# Altium project 平衡车驱动板.PrjPcb
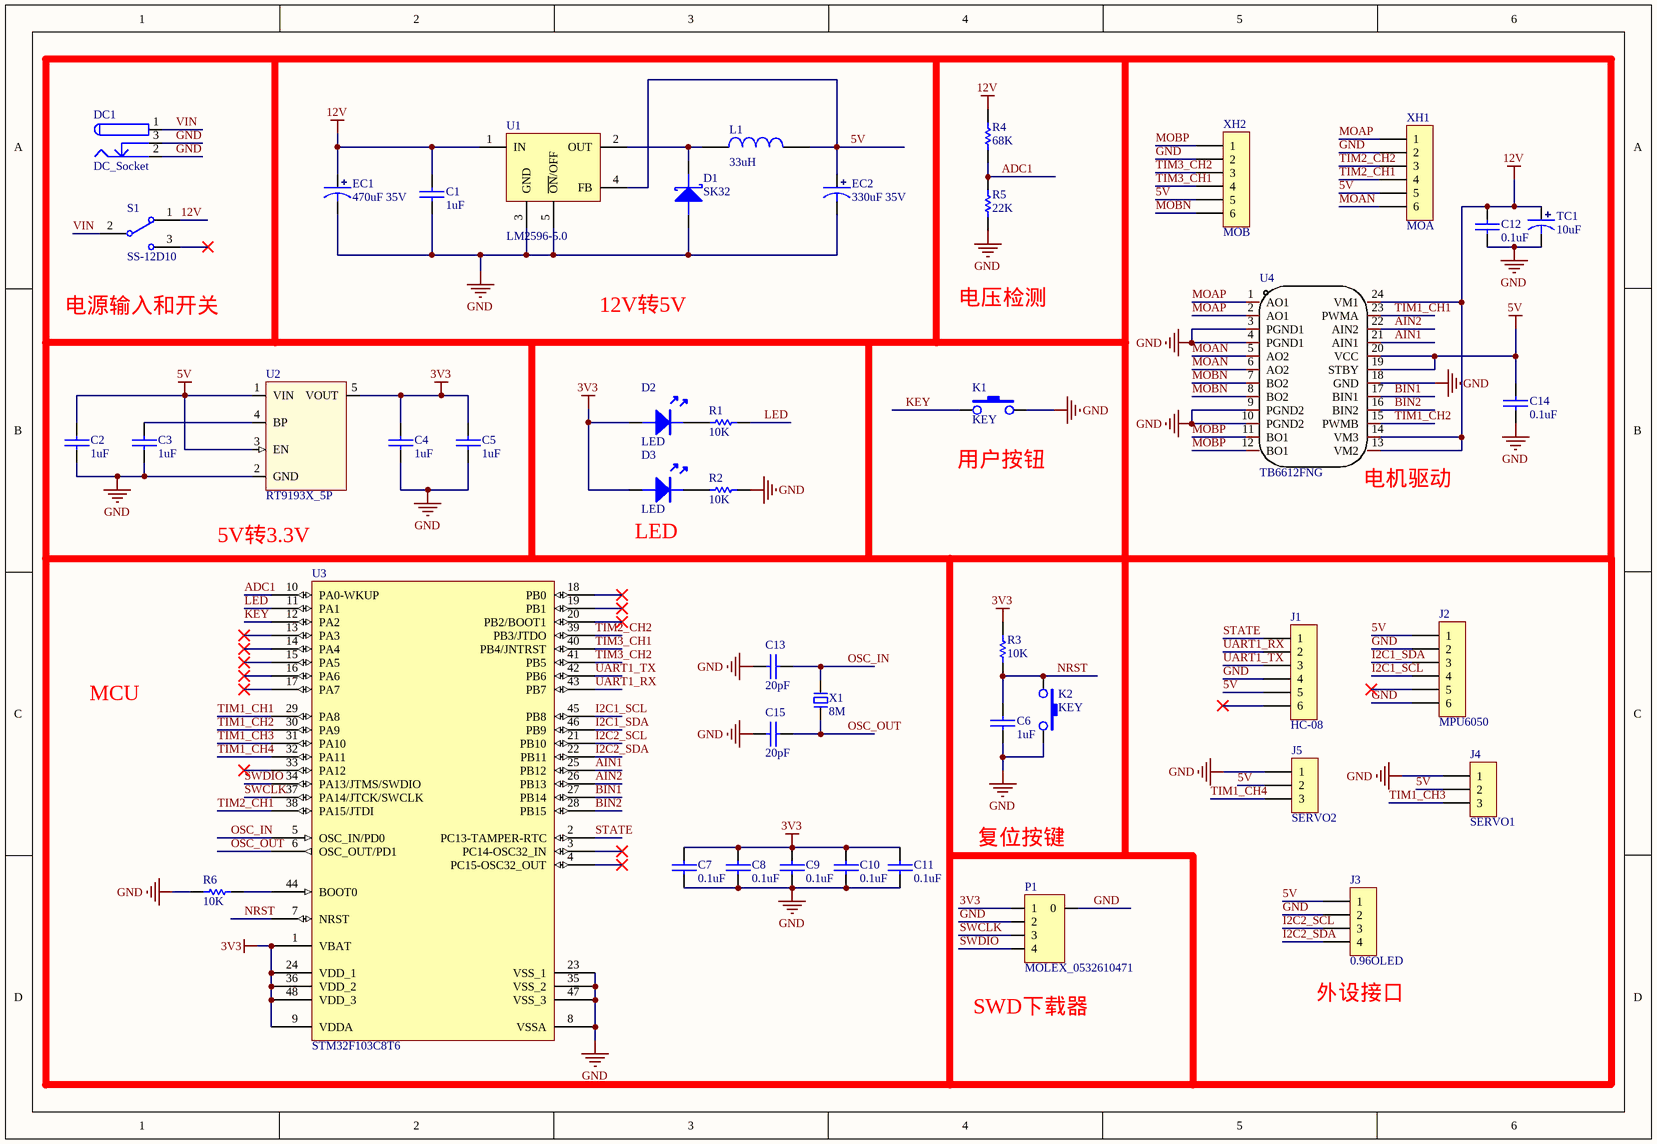
[diagram p0: 平衡车驱动板.SchDoc]
1 sheet, 45 parts. Net scope: global (net labels, ports and power ports of the same name join across sheets).
Board file: 平衡车驱动板.PcbDoc

## Sheet 平衡车驱动板.SchDoc
size 309 x 213 mm

### Parts
C1  1uF  [0603C]
C2  1uF  [0603C]
C3  1uF  [0603C]
C4  1uF  [0603C]
C5  1uF  [0603C]
C6  1uF  [0603C]
C7  0.1uF  [0603C]
C8  0.1uF  [0603C]
C9  0.1uF  [0603C]
C10  0.1uF  [0603C]
C11  0.1uF  [0603C]
C12  0.1uF  [0603C]
C13  20pF  [0603C]
C14  0.1uF  [0603C]
C15  20pF  [0603C]
D1  SK32  [SOD-123]
D2  LED  [LED-0805B]
D3  LED  [LED-0805B]
DC1  DC_Socket  [DC-050]
EC1  470uF 35V  [SMD-EC10X10X10]
EC2  330uF 35V  [SMD-EC10X10X10]
J1  HC-08  [Fe-HDR1X6/2.54-S]
J2  MPU6050  [Fe-HDR1X6/2.54-S]
J3  0.96OLED  [Fe-HDR1X4/2.54-S]
J4  SERVO1  [Pin HDR1X3/2.54mm-S]
J5  SERVO2  [Pin HDR1X3/2.54mm-S]
K1  KEY  [SMD-3X6X2.5]
K2  KEY  [SMD-3X6X2.5]
L1  33uH  [0630L]
P1  MOLEX_0532610471  [MOLEX 0532610471]
R1  10K  [0603R]
R2  10K  [0603R]
R3  10K  [0603R]
R4  68K  [0603R]
R5  22K  [0603R]
R6  10K  [0603R]
S1  SS-12D10  [SS-12D10]
TC1  10uF  [TAJ-B/3528]
U1  LM2596-5.0  [TO263-5A]
U2  RT9193X_5P  [SOT23-5L]
U3  STM32F103C8T6  [LQFP48 7X7]
U4  TB6612FNG  [TB6612-SSOP-24]
X1  8M  [OSC HC-49S]
XH1  MOA  [XH6/2.54mm/90]
XH2  MOB  [XH6/2.54mm/90]

### Nets
3V3: C4.2 C5.2 C7.2 C8.2 C9.2 C10.2 C11.2 D2.A D3.A P1.1 R3.1 U2.5(VOUT) U3.1(VBAT) U3.9(VDDA) U3.24(VDD_1) U3.36(VDD_2) U3.48(VDD_3)
5V: C2.2 C14.2 EC2.1 J1.5 J2.1 J3.1 J4.2 J5.2 L1.2 U1.4(FB) U2.1(VIN) U2.3(EN) U4.19(STBY) U4.20(VCC) XH1.5 XH2.5
12V: C1.2 C12.2 EC1.1 R4.2 S1.1 TC1.1 U1.1(IN) U4.13(VM2) U4.14(VM3) U4.24(VM1)
GND: C1.1 C2.1 C3.1 C4.1 C5.1 C6.1 C7.1 C8.1 C9.1 C10.1 C11.1 C12.1 C13.1 C14.1 C15.1 D1.A DC1.2 DC1.3 EC1.2 EC2.2 J1.4 J2.2 J2.6 J3.2 J4.1 J5.1 K1.3 K2.3 P1.2 P1.SH(0) R2.2 R5.1 R6.2 TC1.2 U1.3(GND) U1.5(~{ON}/OFF) U2.2(GND) U3.8(VSSA) U3.23(VSS_1) U3.35(VSS_2) U3.47(VSS_3) U4.3(PGND1) U4.4(PGND1) U4.9(PGND2) U4.10(PGND2) U4.18(GND) XH1.2 XH2.2
ADC1: R4.1 R5.2 U3.10(PA0-WKUP)
AIN1: U3.25(PB12) U4.21(AIN1)
AIN2: U3.26(PB13) U4.22(AIN2)
BIN1: U3.27(PB14) U4.17(BIN1)
BIN2: U3.28(PB15) U4.16(BIN2)
I2C1_SCL: J2.4 U3.45(PB8)
I2C1_SDA: J2.3 U3.46(PB9)
I2C2_SCL: J3.3 U3.21(PB10)
I2C2_SDA: J3.4 U3.22(PB11)
KEY: K1.1 U3.12(PA2)
LED: R1.2 U3.11(PA1)
MOAN: U4.5(AO2) U4.6(AO2) XH1.6
MOAP: U4.1(AO1) U4.2(AO1) XH1.1
MOBN: U4.7(BO2) U4.8(BO2) XH2.6
MOBP: U4.11(BO1) U4.12(BO1) XH2.1
NRST: C6.2 K2.1 R3.2 U3.7(NRST)
OSC_IN: C13.2 U3.5(OSC_IN/PD0) X1.2
OSC_OUT: C15.2 U3.6(OSC_OUT/PD1) X1.1
STATE: J1.1 U3.2(PC13-TAMPER-RTC)
SWCLK: P1.3 U3.37(PA14/JTCK/SWCLK)
SWDIO: P1.4 U3.34(PA13/JTMS/SWDIO)
TIM1_CH1: U3.29(PA8) U4.23(PWMA)
TIM1_CH2: U3.30(PA9) U4.15(PWMB)
TIM1_CH3: J4.3 U3.31(PA10)
TIM1_CH4: J5.3 U3.32(PA11)
TIM2_CH1: U3.38(PA15/JTDI) XH1.4
TIM2_CH2: U3.39(PB3/JTDO) XH1.3
TIM3_CH1: U3.40(PB4/JNTRST) XH2.4
TIM3_CH2: U3.41(PB5) XH2.3
UART1_RX: J1.2 U3.43(PB7)
UART1_TX: J1.3 U3.42(PB6)
VIN: DC1.1 S1.2
NetC3_2: C3.2 U2.4(BP)
NetD1_K: D1.K L1.1 U1.2(OUT)
NetD2_K: D2.K R1.1
NetD3_K: D3.K R2.1
NetR6_1: R6.1 U3.44(BOOT0)

Not connected (* = marked no-connect by the designer): J1 6*; J2 5*; S1 3*; U3 3(PC14-OSC32_IN)* 4(PC15-OSC32_OUT)* 13(PA3)* 14(PA4)* 15(PA5)* 16(PA6)* 17(PA7)* 18(PB0)* 19(PB1)* 20(PB2/BOOT1)* 33(PA12)*

### Notes on the sheet
- (near S1) 电源输入和开关
- 12V转5V
- 电压检测
- (near K1) 用户按钮
- (near U4) 电机驱动
- 5V转3.3V
- (near D3) LED
- MCU
- 复位按键
- (near P1) SWD下载器
- (near J3) 外设接口

### Library data of the parts
C1-C15 = CAP: 无极性电容
D1 = DIODE SCHOTTKY: 肖特基二极管
EC1 EC2 = SMD_ECAP: 贴片电解电容
J1 J2 = Female HDR1X6
J3 = Female HDR1X4
J4 J5 = Pin HDR1X3
L1 = INDUCTOR
P1 = MOLEX_0532610471: MOLEX_0532610471,4Pin,1.25mm
R1-R6 = RES
TC1 = TCAP: 钽电容
U1 = LM2596-5.0: DC降压芯片
U2 = RT9193X_5P: 5V转3.3V
U4 = TB6612FNG: 双电机驱动
X1 = XTAL-2P: 2脚无源脚晶振
XH1 XH2 = XH6